# Altium schematic sheet 04_ALTIMETER.SchDoc: ALTIMETER
size A4; Author: Gabriel; Organization: Altium Limited; Address1: L3, 12a Rodborough Rd; Address2: Frenchs Forest; Address3: NSW; Address4: Australia 2086; Revision: v2.0; SheetNumber: 4; SheetTotal: 8; Subtitle: XDRONE
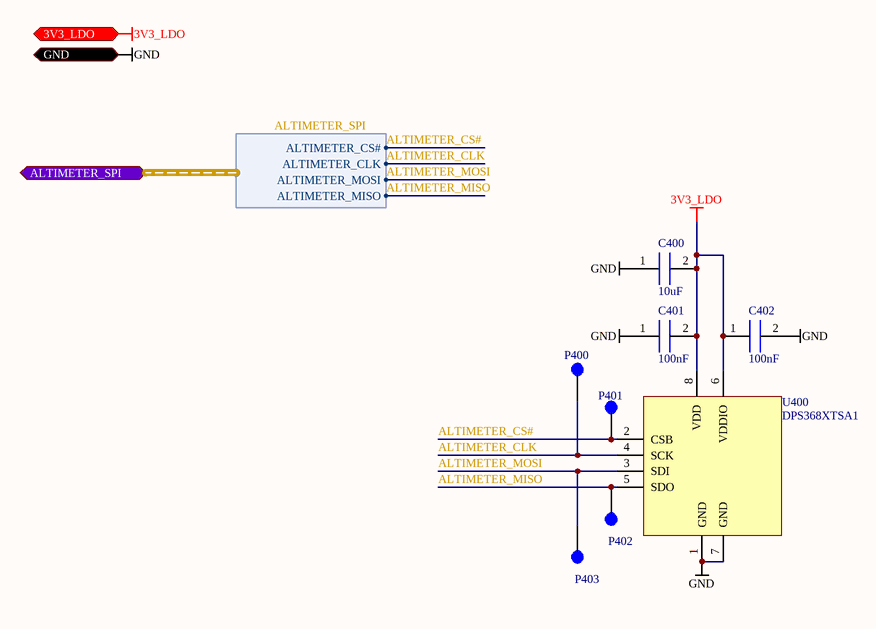
[diagram p0: 04_ALTIMETER.SchDoc]

## Parts
C400  value 10uF  [CAP_0402]  (hidden comment: 10uF_20%_6.3V_0402_GRM155R60J106ME05D)
C401  value 100nF  [CAP_0402]  (hidden comment: 100nF_10%_16V_0402_GRM155R71C104KA88J)
C402  value 100nF  [CAP_0402]  (hidden comment: 100nF_10%_16V_0402_GRM155R71C104KA88J)
P400  TEST_POINT_2mm  [TEST_POINT_2mm]  (value not drawn)
P401  TEST_POINT_2mm  [TEST_POINT_2mm]  (value not drawn)
P402  TEST_POINT_2mm  [TEST_POINT_2mm]  (value not drawn)
P403  TEST_POINT_2mm  [TEST_POINT_2mm]  (value not drawn)
U400  BAR_4V_0.002hPA_500nA_DPS368XTSA1  [DPS368XTSA1]  (value not drawn)

## Ports
3V3_LDO (in), ALTIMETER_SPI (harness ALTIMETER_SPI), GND (in)

## Harnesses
ALTIMETER_SPI: ALTIMETER_MISO, ALTIMETER_MOSI, ALTIMETER_CLK, ALTIMETER_CS#

## Nets
3V3_LDO: C400.2 C401.2 C402.1 U400.6(VDDIO) U400.8(VDD) ; port 3V3_LDO
GND: C400.1 C401.1 C402.2 U400.1(GND) U400.7(GND) ; port GND
ALTIMETER_CLK: P400.1 U400.4(SCK) ; port ALTIMETER_SPI.ALTIMETER_CLK
ALTIMETER_CS#: P401.1 U400.2(CSB) ; port ALTIMETER_SPI.ALTIMETER_CS#
ALTIMETER_MISO: P402.1 U400.5(SDO) ; port ALTIMETER_SPI.ALTIMETER_MISO
ALTIMETER_MOSI: P403.1 U400.3(SDI) ; port ALTIMETER_SPI.ALTIMETER_MOSI

## Notes on the sheet
- TITLE:
- CREATED BY
- MODIFIED DATE
- REV
- PAGE
- /

## Library data of the parts
C400 = 10uF 20% 6.3V 0402 GRM155R60J106ME05D: CAPACITOR 10uF 20% 6.3V 0402 GRM155R60J106ME05D; MANUFACTURER: MURATA; DIELECTRIC: X5R; TOLERANCE: 20%; VOLTAGE RATING: 6.3V; PACKAGING: 0402; MOUNTING: SMD; MANUFACTURER REFERENCE: GRM155R60J106ME05D
C401 C402 = 100nF_10%_16V_0402_GRM155R71C104KA88J: CAPACITOR 100nF 10% X7R 0402; MANUFACTURER: MURATA; VOLTAGE RATING: 16V; DIELECTRIC: X7R; TOLERANCE: 10%; MOUNTING: SMD; MANUFACTURER REFERENCE: GRM155R71C104KA88J; PACKAGING: 0402
U400 = BAR_4V_0.002hPA_500nA_DPS368XTSA1: BAROMETRIC SENSOR 4V 0.002hPA 500nA DPS368XTSA1; MANUFACTURER: INFINEON; INPUT VOLTAGE MIN: 1.7V; CURRENT MAX: 350uA; NUMBER OF GATES: 1; INPUT VOLTAGE MAX: 4V; PACKAGING: 8-VFLGA; MOUNTING: SMD; MANUFACTURER REFERENCE: DPS368XTSA1
P400-P403 = TEST_POINT_2mm: MOUNTING: SMD